# EAGLE design sanguinololu (EAGLE 5.11)
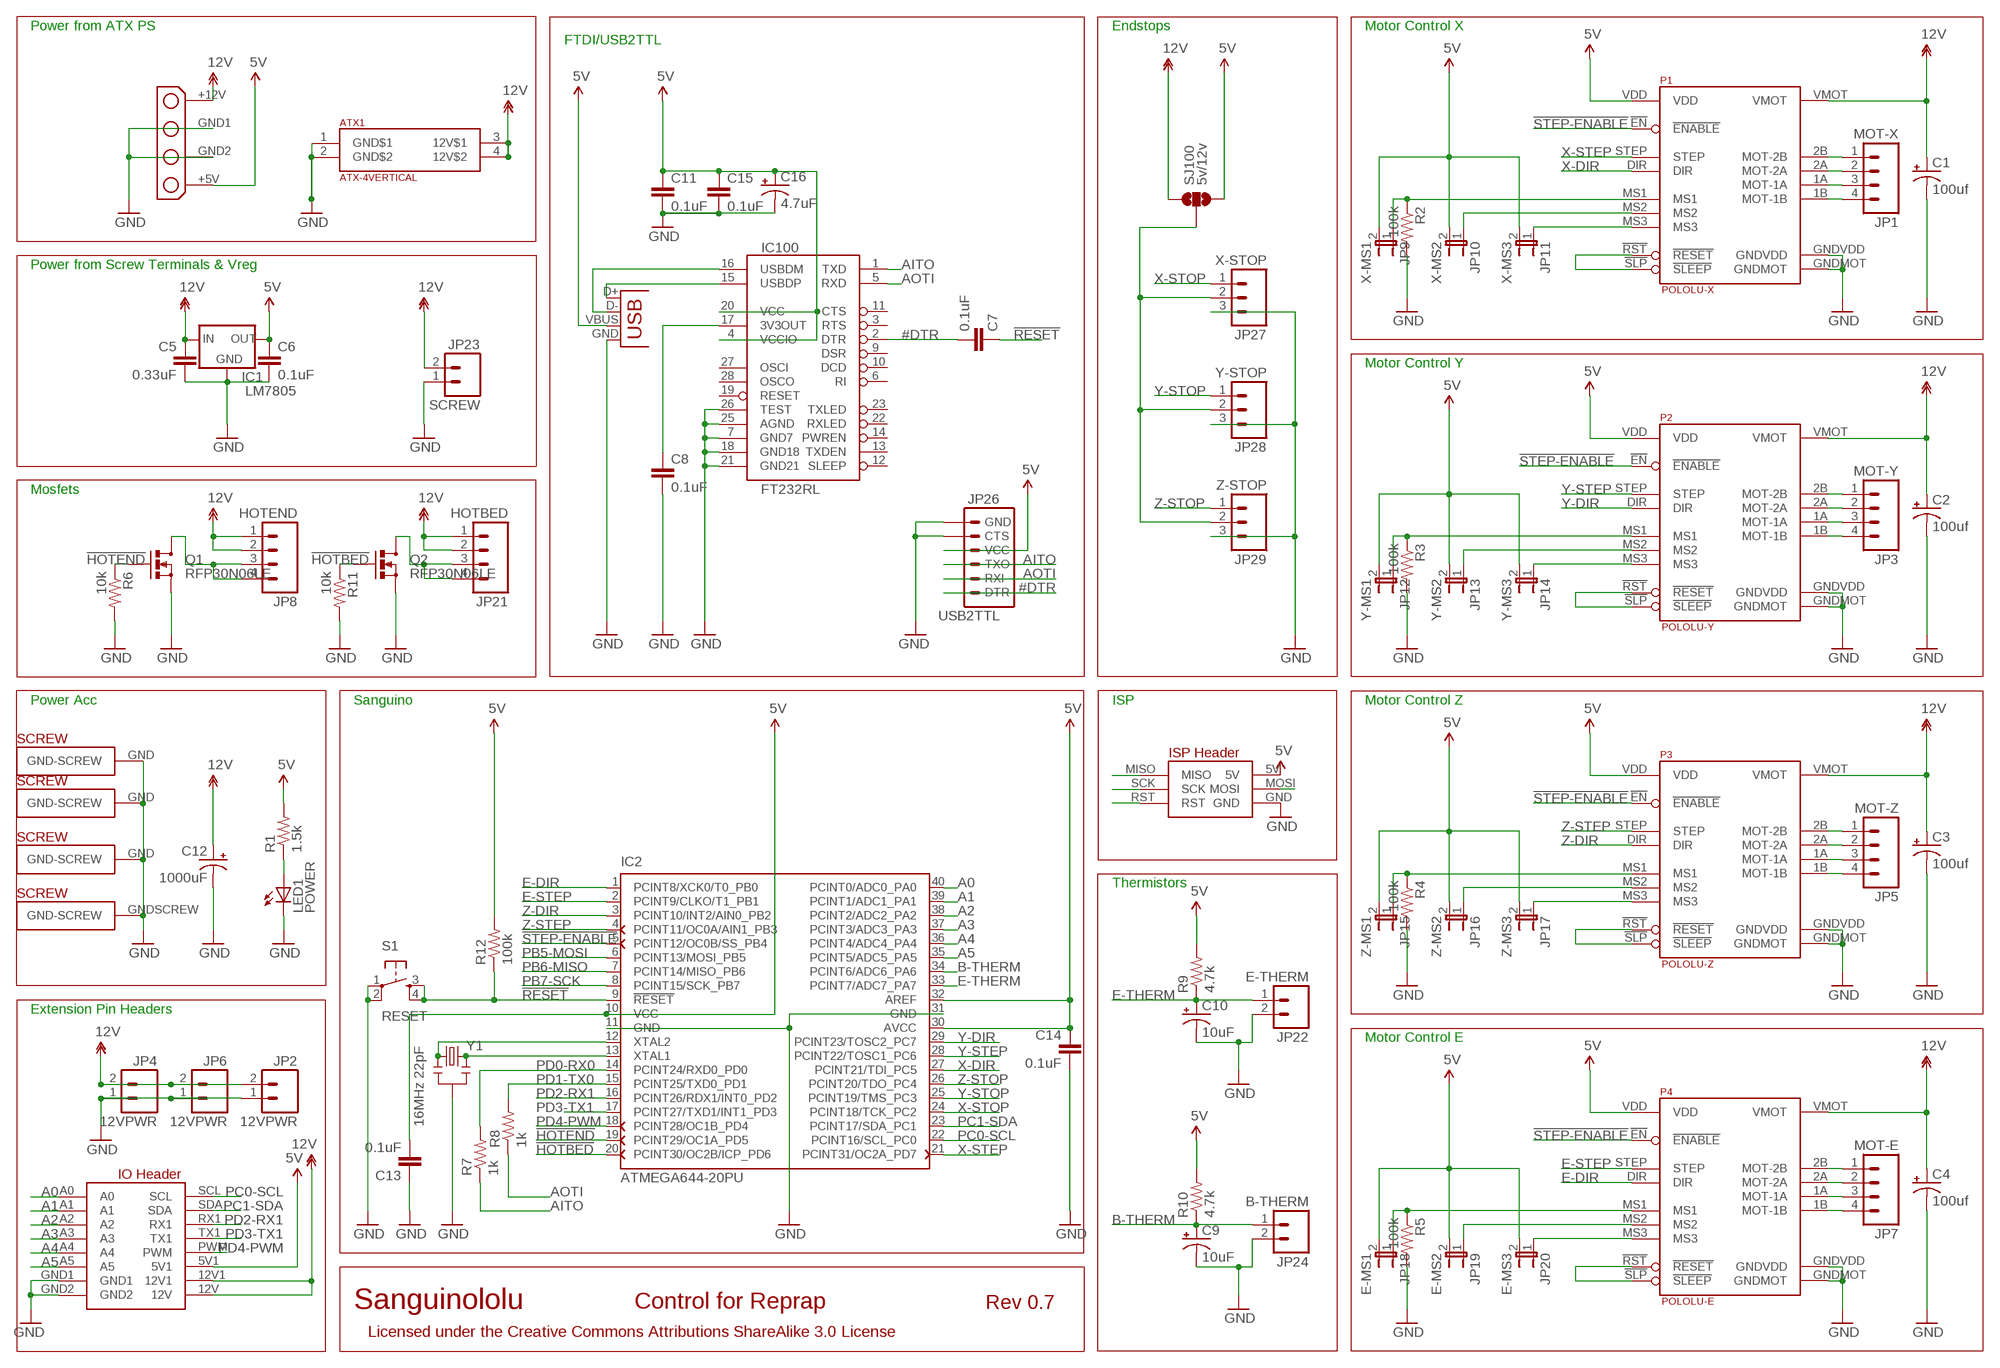
[diagram p0: schematic, sheet 1]

## Parts
ATX1  ATX-4VERTICAL  [MINIFITJR-4-VERTICAL]
C1  100uf  CAP_POLPTH1  [CPOL-RADIAL-100UF-25V]
C2  100uf  CAP_POLPTH1  [CPOL-RADIAL-100UF-25V]
C3  100uf  CAP_POLPTH1  [CPOL-RADIAL-100UF-25V]
C4  100uf  CAP_POLPTH1  [CPOL-RADIAL-100UF-25V]
C5  0.33uF  CAPPTH2  [CAP-PTH-SMALL2]
C6  0.1uF  CAPPTH2  [CAP-PTH-SMALL2]
C7  0.1uF  CAPPTH2  [CAP-PTH-SMALL2]
C8  0.1uF  CAPPTH2  [CAP-PTH-SMALL2]
C9  10uF  CAP_POLPTH2  [CPOL-RADIAL-10UF-25V]
C10  10uF  CAP_POLPTH2  [CPOL-RADIAL-10UF-25V]
C11  0.1uF  CAPPTH2  [CAP-PTH-SMALL2]
C12  1000uF  CAP_POLPTH4  [CPOL-RADIAL-1000UF-25V]
C13  0.1uF  CAPPTH2  [CAP-PTH-SMALL2]
C14  0.1uF  CAPPTH2  [CAP-PTH-SMALL2]
C15  0.1uF  CAPPTH2  [CAP-PTH-SMALL2]
C16  4.7uF  CAP_POLPTH2  [CPOL-RADIAL-10UF-25V]
HDDPWR  5v/12v  DRIVEPWRVERTICAL  [HDD-VERTICAL]
IC1  LM7805  V_REG_78XX  [78XXL-CUSTOM]
IC2  ATMEGA644-20PU  [DIL40]
IC100  FT232RL  FT232RLSSOP  [SSOP28DB]
J1  USB  USBPTH  [USB-B-PTH]
JP1  MOT-X  M04POLAR  [MOLEX-1X4]
JP2  12VPWR  M02POLAR  [MOLEX-1X2]
JP3  MOT-Y  M04POLAR  [MOLEX-1X4]
JP4  12VPWR  M02POLAR  [MOLEX-1X2]
JP5  MOT-Z  M04POLAR  [MOLEX-1X4]
JP6  12VPWR  M02POLAR  [MOLEX-1X2]
JP7  MOT-E  M04POLAR  [MOLEX-1X4]
JP8  HOTEND  M04POLAR  [MOLEX-1X4]
JP9  X-MS1  JUMPER-2PTH  [1X02]
JP10  X-MS2  JUMPER-2PTH  [1X02]
JP11  X-MS3  JUMPER-2PTH  [1X02]
JP12  Y-MS1  JUMPER-2PTH  [1X02]
JP13  Y-MS2  JUMPER-2PTH  [1X02]
JP14  Y-MS3  JUMPER-2PTH  [1X02]
JP15  Z-MS1  JUMPER-2PTH  [1X02]
JP16  Z-MS2  JUMPER-2PTH  [1X02]
JP17  Z-MS3  JUMPER-2PTH  [1X02]
JP18  E-MS1  JUMPER-2PTH  [1X02]
JP19  E-MS2  JUMPER-2PTH  [1X02]
JP20  E-MS3  JUMPER-2PTH  [1X02]
JP21  HOTBED  M04POLAR  [MOLEX-1X4]
JP22  E-THERM  M02PTH  [1X02]
JP23  SCREW  M025MM  [SCREWTERMINAL-5MM-2]
JP24  B-THERM  M02PTH  [1X02]
JP26  USB2TTL  ARDUINO_SERIAL_PROGRAMPTH  [1X06]
JP27  X-STOP  M03POLAR  [MOLEX-1X3]
JP28  Y-STOP  M03POLAR  [MOLEX-1X3]
JP29  Z-STOP  M03POLAR  [MOLEX-1X3]
LED1  POWER  LED3MM  [LED3MM]
P1  POLOLU-X  POLOLU-ALLEGRO  [POLOLU-ALLEGRO-PTH]
P2  POLOLU-Y  POLOLU-ALLEGRO  [POLOLU-ALLEGRO-PTH]
P3  POLOLU-Z  POLOLU-ALLEGRO  [POLOLU-ALLEGRO-PTH]
P4  POLOLU-E  POLOLU-ALLEGRO  [POLOLU-ALLEGRO-PTH]
Q1  RFP30N06LE  MOSFET-NCHANNELPTH2  [TO220V]
Q2  RFP30N06LE  MOSFET-NCHANNELPTH2  [TO220V]
R1  1.5k  RESISTORPTH1  [AXIAL-0.3]
R2  100k  RESISTORPTH1  [AXIAL-0.3]
R3  100k  RESISTORPTH1  [AXIAL-0.3]
R4  100k  RESISTORPTH1  [AXIAL-0.3]
R5  100k  RESISTORPTH1  [AXIAL-0.3]
R6  10k  RESISTORPTH1  [AXIAL-0.3]
R7  1k  RESISTORPTH1  [AXIAL-0.3]
R8  1k  RESISTORPTH1  [AXIAL-0.3]
R9  4.7k  RESISTORPTH1  [AXIAL-0.3]
R10  4.7k  RESISTORPTH1  [AXIAL-0.3]
R11  10k  RESISTORPTH1  [AXIAL-0.3]
R12  100k  RESISTORPTH1  [AXIAL-0.3]
S1  RESET  TAC_SWITCHPTH  [TACTILE-PTH]
SJ100  5v/12v  SOLDERJUMPER_2WAYS  [SJ_3]
U$17  PLATED-SCREW  [PLATEDSCREW]
U$24  IO_HEADERS_SCREW  [IO_HEADER-PLATEDSCREW]
U$37  PLATED-SCREW  [PLATEDSCREW]
U$38  PLATED-SCREW  [PLATEDSCREW]
Y1  16MHz 22pF  RESONATORPTH  [RESONATOR-PTH]

## Nets
3V3: C8.1 IC100.17(3V3OUT)
5V: C6.1 C11.1 C13.2 C14.1 C15.1 C16.1(+) HDDPWR.+5V IC1.OUT IC2.10(VCC) IC2.30(AVCC) IC2.32(AREF) IC100.4(VCCIO) IC100.20(VCC) J1.VBUS JP9.2 JP10.2 JP11.2 JP12.2 JP13.2 JP14.2 JP15.2 JP16.2 JP17.2 JP18.2 JP19.2 JP20.2 JP26.4(VCC) P1.VDD P2.VDD P3.VDD P4.VDD R1.P$2 R9.P$2 R10.P$2 R12.P$2 SJ100.3 U$24.5V U$24.5V1
12V: ATX1.3(12V$1) ATX1.4(12V$2) C1.1(+) C2.1(+) C3.1(+) C4.1(+) C5.1 C12.1(+) HDDPWR.+12V IC1.IN JP2.2 JP4.2 JP6.2 JP8.1 JP8.2 JP21.1 JP21.2 JP23.2 P1.VMOT P2.VMOT P3.VMOT P4.VMOT SJ100.1 U$24.12V U$24.12V1
!HOTBED: IC2.20(PCINT30/OC2B/ICP_PD6) Q2.1(G) R11.P$1
!HOTEND: IC2.19(PCINT29/OC1A_PD5) Q1.1(G) R6.P$1
!RESET: C7.1 IC2.9(!RESET) R12.P$1 S1.3 S1.4 U$24.RST
!STEP-ENABLE: IC2.5(PCINT12/OC0B/SS_PB4) P1.!EN(!ENABLE) P2.!EN(!ENABLE) P3.!EN(!ENABLE) P4.!EN(!ENABLE)
#DTR: C7.2 IC100.2(DTR) JP26.1(DTR)
A0: IC2.40(PCINT0/ADC0_PA0) U$24.A0
A1: IC2.39(PCINT1/ADC1_PA1) U$24.A1
A2: IC2.38(PCINT2/ADC2_PA2) U$24.A2
A3: IC2.37(PCINT3/ADC3_PA3) U$24.A3
A4: IC2.36(PCINT4/ADC4_PA4) U$24.A4
A5: IC2.35(PCINT5/ADC5_PA5) U$24.A5
AITO: IC100.1(TXD) JP26.3(TXO) R7.P$1
AOTI: IC100.5(RXD) JP26.2(RXI) R8.P$1
B-THERM: C9.1(+) IC2.34(PCINT6/ADC6_PA6) JP24.1 R10.P$1
E-DIR: IC2.1(PCINT8/XCK0/T0_PB0) P4.DIR
E-MOT-1A [power]: JP7.3 P4.1A(MOT-1A)
E-MOT-1B [power]: JP7.4 P4.1B(MOT-1B)
E-MOT-2A [power]: JP7.2 P4.2A(MOT-2A)
E-MOT-2B [power]: JP7.1 P4.2B(MOT-2B)
E-MS1: JP18.1 P4.MS1 R5.P$1
E-MS2: JP19.1 P4.MS2
E-MS3: JP20.1 P4.MS3
E-RESETSLEEP: P4.!RST(!RESET) P4.!SLP(!SLEEP)
E-STEP: IC2.2(PCINT9/CLKO/T1_PB1) P4.STEP
E-THERM: C10.1(+) IC2.33(PCINT7/ADC7_PA7) JP22.1 R9.P$1
ENDSTOP+V: JP27.2 JP28.2 JP29.2 SJ100.2
GND [power]: ATX1.1(GND$1) ATX1.2(GND$2) C1.2(-) C2.2(-) C3.2(-) C4.2(-) C5.2 C6.2 C8.2 C9.2(-) C10.2(-) C11.2 C12.2(-) C13.1 C14.2 C15.2 C16.2(-) HDDPWR.GND1(GND) HDDPWR.GND2(_GND) IC1.GND IC2.11(GND) IC2.31(GND) IC100.7(GND7) IC100.18(GND18) IC100.21(GND21) IC100.25(AGND) IC100.26(TEST) J1.GND JP2.1 JP4.1 JP6.1 JP22.2 JP23.1 JP24.2 JP26.5(CTS) JP26.6(GND) JP27.3 JP28.3 JP29.3 LED1.K(C) P1.GNDMOT P1.GNDVDD P2.GNDMOT P2.GNDVDD P3.GNDMOT P3.GNDVDD P4.GNDMOT P4.GNDVDD Q1.3(S) Q2.3(S) R2.P$2 R3.P$2 R4.P$2 R5.P$2 R6.P$2 R11.P$2 S1.1 S1.2 U$17.GND(GND-SCREW) U$24.GND U$24.GND1 U$24.GND2 U$24.GNDSCREW(GND-SCREW) U$37.GND(GND-SCREW) U$38.GND(GND-SCREW) Y1.2
HOTBED-GND [power]: JP21.3 JP21.4 Q2.2(D)
HOTEND-GND [power]: JP8.3 JP8.4 Q1.2(D)
LED1: LED1.A R1.P$1
PB5-MOSI: IC2.6(PCINT13/MOSI_PB5) U$24.MOSI
PB6-MISO: IC2.7(PCINT14/MISO_PB6) U$24.MISO
PB7-SCK: IC2.8(PCINT15/SCK_PB7) U$24.SCK
PC0-SCL: IC2.22(PCINT16/SCL_PC0) U$24.SCL
PC1-SDA: IC2.23(PCINT17/SDA_PC1) U$24.SDA
PD0-RX0: IC2.14(PCINT24/RXD0_PD0) R7.P$2
PD1-TX0: IC2.15(PCINT25/TXD0_PD1) R8.P$2
PD2-RX1: IC2.16(PCINT26/RDX1/INT0_PD2) U$24.RX1
PD3-TX1: IC2.17(PCINT27/TXD1/INT1_PD3) U$24.TX1
PD4-PWM: IC2.18(PCINT28/OC1B_PD4) U$24.PWM
USBDM: IC100.16(USBDM) J1.D-
USBDP: IC100.15(USBDP) J1.D+
X-DIR: IC2.27(PCINT21/TDI_PC5) P1.DIR
X-MOT-1A [power]: JP1.3 P1.1A(MOT-1A)
X-MOT-1B [power]: JP1.4 P1.1B(MOT-1B)
X-MOT-2A [power]: JP1.2 P1.2A(MOT-2A)
X-MOT-2B [power]: JP1.1 P1.2B(MOT-2B)
X-MS1: JP9.1 P1.MS1 R2.P$1
X-MS2: JP10.1 P1.MS2
X-MS3: JP11.1 P1.MS3
X-RESETSLEEP: P1.!RST(!RESET) P1.!SLP(!SLEEP)
X-STEP: IC2.21(PCINT31/OC2A_PD7) P1.STEP
X-STOP: IC2.24(PCINT18/TCK_PC2) JP27.1
XTAL1: IC2.13(XTAL1) Y1.3
XTAL2: IC2.12(XTAL2) Y1.1
Y-DIR: IC2.29(PCINT23/TOSC2_PC7) P2.DIR
Y-MOT-1A [power]: JP3.3 P2.1A(MOT-1A)
Y-MOT-1B [power]: JP3.4 P2.1B(MOT-1B)
Y-MOT-2A [power]: JP3.2 P2.2A(MOT-2A)
Y-MOT-2B [power]: JP3.1 P2.2B(MOT-2B)
Y-MS1: JP12.1 P2.MS1 R3.P$1
Y-MS2: JP13.1 P2.MS2
Y-MS3: JP14.1 P2.MS3
Y-RESETSLEEP: P2.!RST(!RESET) P2.!SLP(!SLEEP)
Y-STEP: IC2.28(PCINT22/TOSC1_PC6) P2.STEP
Y-STOP: IC2.25(PCINT19/TMS_PC3) JP28.1
Z-DIR: IC2.3(PCINT10/INT2/AIN0_PB2) P3.DIR
Z-MOT-1A [power]: JP5.3 P3.1A(MOT-1A)
Z-MOT-1B [power]: JP5.4 P3.1B(MOT-1B)
Z-MOT-2A [power]: JP5.2 P3.2A(MOT-2A)
Z-MOT-2B [power]: JP5.1 P3.2B(MOT-2B)
Z-MS1: JP15.1 P3.MS1 R4.P$1
Z-MS2: JP16.1 P3.MS2
Z-MS3: JP17.1 P3.MS3
Z-RESETSLEEP: P3.!RST(!RESET) P3.!SLP(!SLEEP)
Z-STEP: IC2.4(PCINT11/OC0A/AIN1_PB3) P3.STEP
Z-STOP: IC2.26(PCINT20/TDO_PC4) JP29.1
Unconnected: IC100.3(RTS) IC100.6(RI) IC100.9(DSR) IC100.10(DCD) IC100.11(CTS) IC100.12(SLEEP) IC100.13(TXDEN) IC100.14(PWREN) IC100.19(RESET) IC100.22(RXLED) IC100.23(TXLED) IC100.27(OSCI) IC100.28(OSCO)

## Notes on the sheet
- Power from ATX PS | Endstops | Motor Control X
- FTDI/USB2TTL
- Power from Screw Terminals & Vreg
- Motor Control Y
- Mosfets
- Power Acc | Sanguino | ISP | Motor Control Z
- Thermistors
- Extension Pin Headers
- Motor Control E
- Sanguinololu | Control for Reprap | Rev 0.7
- Licensed under the Creative Commons Attributions ShareAlike 3.0 License

## Library data of the parts
ATX1 = atx-power-supply:ATX-4
C1-C4 C9 C10 C12 C16 = SparkFun:CAP_POL: Capacitor Polarized These are standard SMD and PTH capacitors. Normally 10uF, 47uF, and 100uF in electrolytic and tantalum varieties. Always verify the external diameter of the through hole cap, it varies with capacity, voltage, and manufacturer. The EIA devices should be standard.
C5-C8 C11 C13-C15 = SparkFun:CAP: Capacitor Standard 0603 ceramic capacitor, and 0.1" leaded capacitor.
HDDPWR = atx-power-supply:DRIVEPWR
IC1 = SparkFun:V_REG_78XX: Voltage Regulator Standard 7805 5V regulator. IGO (Input Ground Output). Spark Fun Electronics SKU : COM-00107
IC2 = atmel:ATMEGA644-*PU: 8-bit Microcontroller with 64K Bytes In-System Programmable Flash Auto generated by make-symbol-device-package-bsdl.ulp Rev. 34 Source: http://www.atmel.com/dyn/resources/prod_documents/doc2593.pdf; MPN: ATMEGA644-20PU; OC_FARNELL: 1288340; OC_NEWARK: 23M5060
IC100 = SparkFun:FT232RL: USB UART FT232RL 4th Generation USB UART (USB <-> Serial) Controller. Spark Fun Electronics SKU : COM-00650
J1 = SparkFun:USB: USB Connectors USB-B-PTH is fully proven SKU : PRT-00139 USB-miniB is fully proven SKU : PRT-00587 USB-A-PCB is untested. USB-A-H is throughly reviewed, but untested. Spark Fun Electronics SKU : PRT-00437 USB-B-SMT is throughly reviewed, but untested. Needs silkscreen touching up. USB-A-S has not been used/tested USB-MB-H has not been used/tested
JP1 JP3 JP5 JP7 JP8 JP21 = SparkFun:M04: Header 4 Standard 4-pin 0.1" header. Use with straight break away headers (SKU : PRT-00116), right angle break away headers (PRT-00553), swiss pins (PRT-00743), machine pins (PRT-00117), and female headers (PRT-00115). Molex polarized connector foot print use with SKU : PRT-08231 with associated crimp pins and housings.
JP2 JP4 JP6 JP22-JP24 = SparkFun:M02: Header 2 Standard 2-pin 0.1" header. Use with straight break away headers (SKU : PRT-00116), right angle break away headers (PRT-00553), swiss pins (PRT-00743), machine pins (PRT-00117), and female headers (PRT-00115). Molex polarized connector foot print use with SKU : PRT-08233 with associated crimp pins and housings.
JP9-JP20 = SparkFun:JUMPER-2: Jumper Basic 0.1" spaced jumper. Use with breakaway headers.
JP26 = SparkFun:ARDUINO_SERIAL_PROGRAM
JP27-JP29 = SparkFun:M03: Header 3 Standard 3-pin 0.1" header. Use with straight break away headers (SKU : PRT-00116), right angle break away headers (PRT-00553), swiss pins (PRT-00743), machine pins (PRT-00117), and female headers (PRT-00115). Molex polarized connector foot print use with SKU : PRT-08232 with associated crimp pins and housings.
LED1 = SparkFun:LED: LEDs Standard schematic elements and footprints for 5mm, 3mm, 1206, and 0603 sized LEDs. 5mm - Spark Fun Electronics SKU : COM-00529 (and others)
P1-P4 = pololu-allegro:POLOLU-ALLEGRO
Q1 Q2 = SparkFun:MOSFET-NCHANNEL
R1-R12 = SparkFun:RESISTOR: Resistor Basic schematic elements and footprints for 0603, 1206, and PTH 1/10th watt (small) resistors.
S1 = SparkFun:TAC_SWITCH: Momentary Switch Button commonly used for reset or general input. Spark Fun Electronics SKU : COM-00097
SJ100 = SparkFun:SOLDERJUMPER_2WAY: Solder Jumper 2 way solder jumper
U$17 U$37 U$38 = Sanguinololu:PLATED-SCREW
U$24 = Sanguinololu:IO_HEADERS_SCREW
Y1 = SparkFun:RESONATOR: Resonator Small SMD resonator. This is the itty bitty 10/20MHz resonators with built in caps. CSTCE10M0G55 and CSTCE20M0V53. Footprint has been reviewed closely but hasn't been tested yet.

## Board
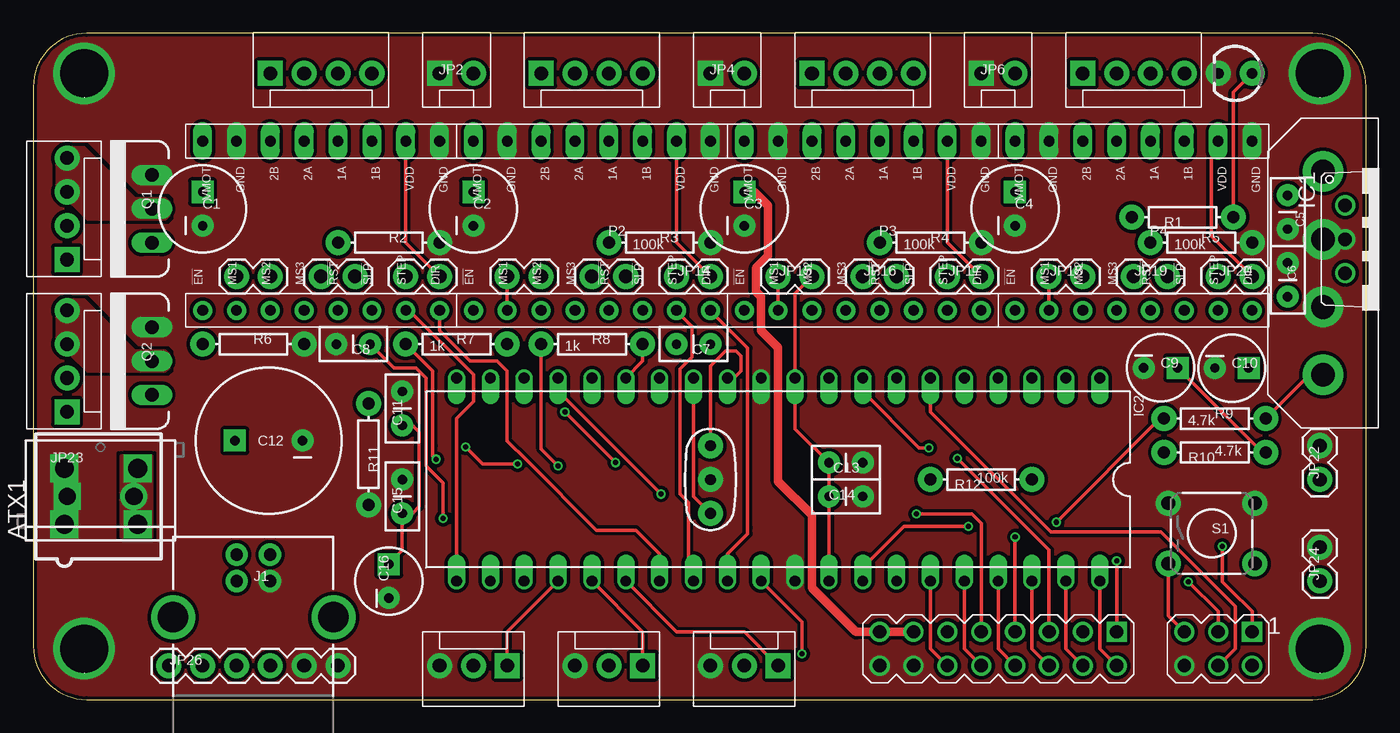
[diagram p1: board, top side]
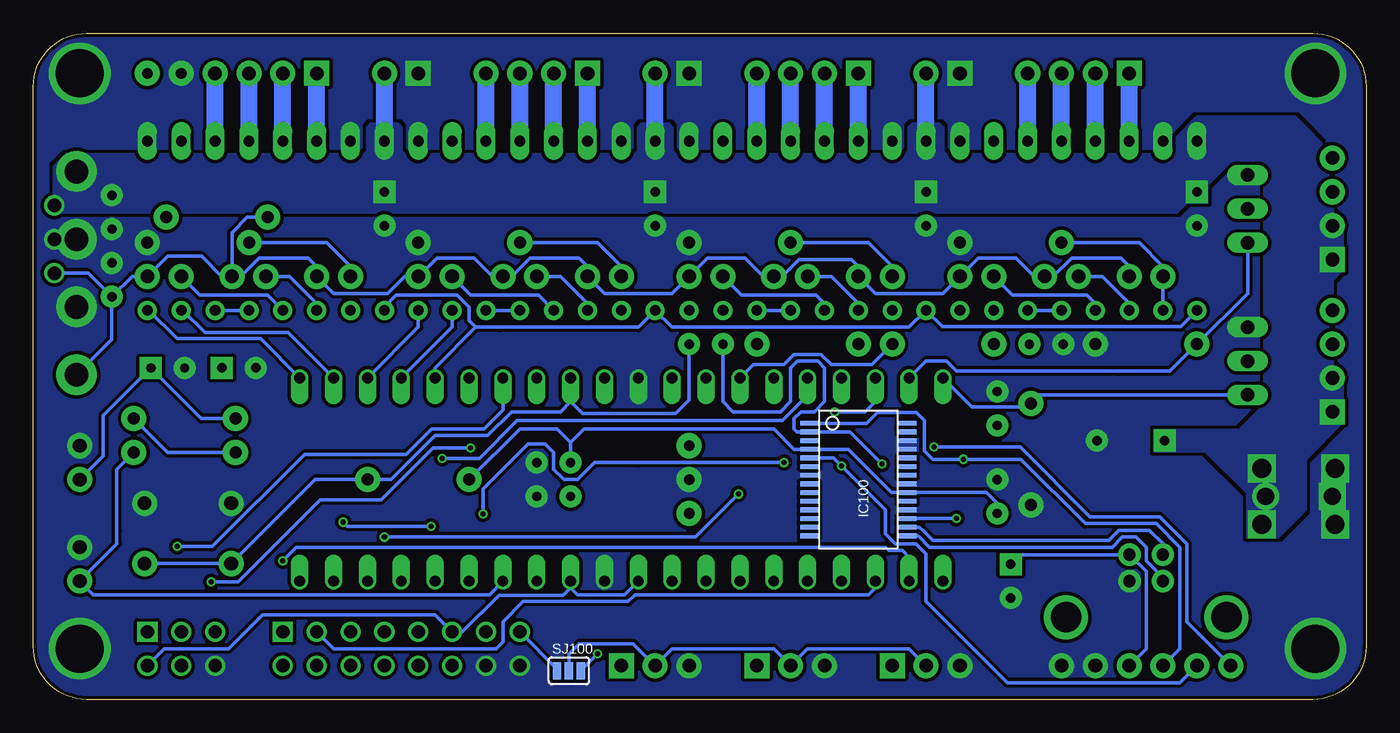
[diagram p2: board, bottom side, seen from below]

Size 100 x 50 mm. Coordinates in mm from the lower left corner, seen from the top.
Outline: 0,4 arc90 4,0 96,0 arc90 100,4 100,46 arc90 96,50 4,50 arc90 0,46 0,4
Copper layers (1*16): Top 0.035mm / dielectric 1.5mm / Bottom 0.035mm
Design rules "Fusion_eagle_rule_v1.1-strict": minimum track width 10mil, minimum drill 15mil, track to track 8mil, track to pad 8mil, pad to pad 8mil, via to via 8mil, smd to smd 0mil, copper to edge 10mil, drill to drill 10mil, minimum pad ring 10mil, minimum via ring 6mil, stop-mask expansion 2mil, vias tented up to drill 100mil, thermal gap 10mil

### Footprints (pad centres in the part's own frame; a part is rotated, then mirrored left to right if it is on the bottom)
MINIFITJR-4-VERTICAL = drill 1.4 square: 1 2.1,-2.75; 2 -2.1,-2.75; 3 2.1,2.75; 4 -2.1,2.75
CPOL-RADIAL-100UF-25V = drill 0.7 pad 1.651 square: 1 1.27,0 | drill 0.7 pad 1.651 round: 2 -1.27,0
CAP-PTH-SMALL2 = drill 0.7 pad 1.651 round: 1 0,0; 2 2.54,0
CPOL-RADIAL-10UF-25V = drill 0.7 pad 1.651 square: 1 1.27,0 | drill 0.7 pad 1.651 round: 2 -1.27,0
CPOL-RADIAL-1000UF-25V = drill 0.7 pad 1.651 square: 1 2.54,0 | drill 0.7 pad 1.651 round: 2 -2.54,0
HDD-VERTICAL = drill 1.778 pad 3.048 round: +5V -15.24,0; +12V 0,0; GND1 -10.16,0; GND2 -5.08,0
78XXL-CUSTOM = drill 1.016 round: GND 0,0; IN -2.54,0; OUT 2.54,0
DIL40 = drill 0.813 offset: 1 -24.13,-7.62; 2 -21.59,-7.62; 3 -19.05,-7.62; 4 -16.51,-7.62; 5 -13.97,-7.62; 6 -11.43,-7.62; 7 -8.89,-7.62; 8 -6.35,-7.62; 9 -3.81,-7.62; 10 -1.27,-7.62; 11 1.27,-7.62; 12 3.81,-7.62; 13 6.35,-7.62; 14 8.89,-7.62; 15 11.43,-7.62; 16 13.97,-7.62; 17 16.51,-7.62; 18 19.05,-7.62; 19 21.59,-7.62; 20 24.13,-7.62; 21 24.13,7.62; 22 21.59,7.62; 23 19.05,7.62; 24 16.51,7.62; 25 13.97,7.62; 26 11.43,7.62; 27 8.89,7.62; 28 6.35,7.62; 29 3.81,7.62; 30 1.27,7.62; 31 -1.27,7.62; 32 -3.81,7.62; 33 -6.35,7.62; 34 -8.89,7.62; 35 -11.43,7.62; 36 -13.97,7.62; 37 -16.51,7.62; 38 -19.05,7.62; 39 -21.59,7.62; 40 -24.13,7.62
SSOP28DB = smd 0.348 x 1.397: 1 -4.225,-3.656; 2 -3.575,-3.656; 3 -2.925,-3.656; 4 -2.275,-3.656; 5 -1.625,-3.656; 6 -0.975,-3.656; 7 -0.325,-3.656; 8 0.325,-3.656; 9 0.975,-3.656; 10 1.625,-3.656; 11 2.275,-3.656; 12 2.925,-3.656; 13 3.575,-3.656; 14 4.225,-3.656; 15 4.225,3.656; 16 3.575,3.656; 17 2.925,3.656; 18 2.275,3.656; 19 1.625,3.656; 20 0.975,3.656; 21 0.325,3.656; 22 -0.325,3.656; 23 -0.975,3.656; 24 -1.625,3.656; 25 -2.275,3.656; 26 -2.925,3.656; 27 -3.575,3.656; 28 -4.225,3.656
USB-B-PTH = drill 0.914 pad 1.676 round: D+ 0,1.25; D- 1.981,1.25; GND 0,-1.25; VBUS 1.981,-1.25 | drill 2.286 round: P$1 -2.718,-6.02; P$2 -2.718,6.02
MOLEX-1X4 = drill 1.016 pad 1.88 square: 1 0,0 | drill 1.016 pad 1.88 round: 2 2.54,0; 3 5.08,0; 4 7.62,0
MOLEX-1X2 = drill 1.016 pad 1.88 square: 1 0,0 | drill 1.016 pad 1.88 round: 2 2.54,0
1X02 = drill 1.016 pad 1.88 round: 1 0,0; 2 2.54,0
SCREWTERMINAL-5MM-2 = drill 1.3 pad 2.032 square: 1 0,0 | drill 1.3 pad 2.032 round: 2 5,0
1X06 = drill 1.016 pad 1.88 round: 1 0,0; 2 2.54,0; 3 5.08,0; 4 7.62,0; 5 10.16,0; 6 12.7,0
MOLEX-1X3 = drill 1.016 pad 1.88 square: 1 0,0 | drill 1.016 pad 1.88 round: 2 2.54,0; 3 5.08,0
LED3MM = drill 0.813 pad 1.88 round: A -1.27,0; K 1.27,0
POLOLU-ALLEGRO-PTH = drill 0.8 pad 1.422 long: 1A 6.35,-1.27; 1B 6.35,-3.81; 2A 6.35,1.27; 2B 6.35,3.81; GNDMOT 6.35,6.35; GNDVDD 6.35,-8.89; VDD 6.35,-6.35; VMOT 6.35,8.89 | drill 0.8 pad 1.422 round: !EN -6.35,8.89; !RST -6.35,-1.27; !SLP -6.35,-3.81; DIR -6.35,-8.89; MS1 -6.35,6.35; MS2 -6.35,3.81; MS3 -6.35,1.27; STEP -6.35,-6.35
TO220V = drill 1.016 long: 1 -2.54,0; 2 0,0; 3 2.54,0
AXIAL-0.3 = drill 0.9 pad 1.88 round: P$1 -3.81,0; P$2 3.81,0
TACTILE-PTH = drill 1.016 pad 1.88 round: 1 -3.251,2.261; 2 3.251,2.261; 3 -3.251,-2.261; 4 3.251,-2.261
SJ_3 = smd 0.635 x 1.27: 1 -0.889,0; 2 0,0; 3 0.889,0
PLATEDSCREW = drill 3.6 round: GND 0,0
IO_HEADER-PLATEDSCREW = drill 1 round: 5V -5.08,-1.27; 5V1 -27.94,1.27; 12V -33.02,1.27; 12V1 -30.48,1.27; A0 -15.24,-1.27; A1 -17.78,-1.27; A2 -20.32,-1.27; A3 -22.86,-1.27; A4 -25.4,-1.27; A5 -27.94,-1.27; GND -10.16,-1.27; GND1 -30.48,-1.27; GND2 -33.02,-1.27; MOSI -7.62,-1.27; PWM -25.4,1.27; RST -10.16,1.27; RX1 -20.32,1.27; SCK -7.62,1.27; SDA -17.78,1.27; TX1 -22.86,1.27 | drill 3.6 round: GNDSCREW 0,0 | drill 1 square: MISO -5.08,1.27; SCL -15.24,1.27
RESONATOR-PTH = drill 0.8 pad 1.88 round: 1 -2.54,0; 2 0,0; 3 2.54,0

### Placement (x,y rotation side)
ATX1  5.08,15.24 270 top
C1  12.7,36.83 90 top
C2  33.02,36.83 90 top
C3  53.34,36.83 90 top
C4  73.66,36.83 90 top
C5  94.11,37.85 270 top
C6  94.11,30.23 90 top
C7  50.8,26.67 180 top
C8  25.27,26.67 180 top
C9  84.58,24.89 0 top
C10  89.92,24.88 0 top
C11  27.69,20.57 90 top
C12  17.65,19.43 180 top
C13  62.23,17.78 180 top
C14  59.69,15.24 0 top
C15  27.69,13.97 90 top
C16  26.67,8.89 90 top
HDDPWR  96.76,39.62 90 top
IC1  98.42,34.54 270 top
IC2  55.88,16.51 180 top
IC100  38.1,16.51 270 bottom
J1  16.51,8.89 90 top
JP1  17.78,46.99 0 top
JP2  30.48,46.99 0 top
JP3  38.1,46.99 0 top
JP4  50.8,46.99 0 top
JP5  58.42,46.99 0 top
JP6  71.12,46.99 0 top
JP7  78.74,46.99 0 top
JP8  2.54,33.02 90 top
JP9  15.24,31.75 0 top
JP10  21.59,31.75 0 top
JP11  27.94,31.75 0 top
JP12  35.56,31.75 0 top
JP13  41.91,31.75 0 top
JP14  48.26,31.75 0 top
JP15  55.88,31.75 0 top
JP16  62.23,31.75 0 top
JP17  68.58,31.75 0 top
JP18  76.2,31.75 0 top
JP19  82.55,31.75 0 top
JP20  88.9,31.75 0 top
JP21  2.54,21.59 90 top
JP22  96.52,16.51 90 top
JP23  2.54,15.24 0 top
JP24  96.52,8.89 90 top
JP26  10.16,2.54 0 top
JP27  35.56,2.54 180 top
JP28  45.72,2.54 180 top
JP29  55.88,2.54 180 top
LED1  90.17,46.99 180 top
P1  21.59,35.56 90 top
P2  41.91,35.56 90 top
P3  62.23,35.56 90 top
P4  82.55,35.56 90 top
Q1  8.89,36.83 90 top
Q2  8.89,25.4 90 top
R1  86.23,36.2 180 top
R2  26.67,34.29 0 top
R3  46.99,34.29 0 top
R4  67.31,34.29 0 top
R5  87.63,34.29 0 top
R6  16.51,26.67 0 top
R7  31.75,26.67 0 top
R8  41.91,26.67 0 top
R9  88.65,21.08 0 top
R10  88.65,18.54 180 top
R11  25.15,18.41 270 top
R12  71.12,16.51 180 top
S1  88.41,12.46 0 top
SJ100  59.82,2.16 0 bottom
U$17  3.81,3.81 0 top
U$24  96.52,3.81 0 top
U$37  3.81,46.99 0 top
U$38  96.52,46.99 0 top
Y1  50.8,16.51 270 top

### Tracks (layer width: path | path; a pad name or v marks a point on that pad's centre or on a via)
3V3  (via drill 0.38)
  Top 0.254: v30.73,13.59 30.73,16.26 29.46,17.53 29.46,24.13 28.7,24.89 27.05,24.89 C8.1
  Bottom 0.254: v30.73,13.59 IC100.17
5V  (via drill 0.38)
  Top 0.254: IC2.32 C14.1 C13.2 57.15,20.32 IC2.10 57.15,30.48 JP15.2 | P1.VDD 27.94,34.29 JP11.2 | P2.VDD 48.26,34.29 JP14.2 | P3.VDD 68.58,34.29 JP17.2 | P4.VDD 88.9,41.15 88.39,40.64 88.39,34.8 JP20.2 | v57.66,3.43 57.66,5.84 IC2.30 | C16.1 27.69,11.18 C15.1 28.45,13.97 28.96,14.48 28.96,19.3 28.96,20.07 28.45,20.57 C11.1 | R9.P$2 95.76,24.38 HDDPWR.+5V
  Bottom 0.254: IC100.20 34.44,15.49 | 59.69,8.38 59.18,7.87 55.63,7.87 IC2.30 | IC2.32 59.69,8.38 | 59.69,8.38 60.25,7.82 63.93,7.82 65.08,7.82 67.82,5.08 U$24.5V1 69.85,6.35 82.8,6.35 85.34,3.81 90.17,3.81 U$24.5V | IC100.20 35.6,15.54 38.85,18.79 IC100.4 42.91,18.79 44.45,20.32 58.67,20.32 59.69,19.3 | R12.P$2 63.5,20.32 60.71,20.32 59.69,19.3 | 59.69,19.3 C13.2 | R10.P$2 89.92,18.54 R9.P$2 | JP9.2 17.78,32.51 18.41,33.15 22.1,33.15 23.5,31.75 JP10.2 24.89,31.75 26.29,33.15 29.08,33.15 JP11.2 31.75,30.48 36.83,30.48 JP12.2 38.1,32.51 38.61,33.02 42.55,33.02 43.81,31.75 JP13.2 45.21,31.75 46.61,33.15 49.4,33.15 JP14.2 52.07,30.48 57.15,30.48 JP15.2 58.42,32.51 59.05,33.15 62.74,33.15 64.14,31.75 JP16.2 65.53,31.75 66.93,33.15 69.72,33.15 JP17.2 71.63,31.75 | JP19.2 84.45,31.75 83.06,33.15 79.38,33.15 78.74,32.51 JP18.2 77.47,30.48 73.41,30.48 72.14,31.75 | JP19.2 85.85,31.75 87.38,33.27 89.92,33.27 JP20.2 92.58,31.75 C6.1 | R1.P$2 83.95,36.2 85.09,35.05 JP19.2 | 58.8,2.16 SJ100.3 v57.66,3.43 | IC100.20 28.49,15.54 27.69,14.73 C15.1 | JP26.4 16.51,3.81 16.51,9.62 J1.VBUS 25.96,10.87 C16.1 | 71.63,31.75 72.14,31.75 | 71.63,31.75 72.14,31.75 | 71.63,31.75 72.14,31.75 | HDDPWR.+5V 94.11,27.04 C6.1 | C6.1 95.89,32 IC1.OUT
12V
  Top 0.635: C3.1 54.1,38.1 55.12,37.08 55.12,33.27 54.23,32.38 54.23,30.61 54.61,30.23 54.61,27.69 55.88,26.42 55.88,16.38 58.42,13.84 58.42,8.38 61.72,5.08 U$24.12V U$24.12V1
  Bottom 0.254: 60.71,2.29 SJ100.1 60.71,2.29 | 60.71,2.29 U$24.12V
  Bottom 1.27: P2.VMOT JP2.2 | P3.VMOT JP4.2 | P4.VMOT JP6.2
  pour Top (no thermals): 6.6,12.19 6.6,18.29 8.89,18.29 8.89,12.19
  pour Bottom (isolate 0.254, no thermals): 2.54,36.58 2.54,40.89 5.33,43.69 12.7,43.69 14.22,42.16 14.22,41.15 14.48,40.89 31.5,40.89 31.75,41.15 31.75,42.93 32,43.18 34.04,43.18 34.29,42.93 34.29,41.15 34.54,40.89 51.82,40.89 52.07,41.15 52.07,42.93 52.32,43.18 54.36,43.18 54.61,42.93 54.61,41.15 54.86,40.89 72.14,40.89 72.39,41.15 72.39,42.93 72.64,43.18 74.68,43.18 74.93,42.93 74.93,41.15 75.18,40.89 97.54,40.89 98.42,40.01 98.42,36.58 14.22,36.58 13.46,37.34 11.94,37.34 11.94,38.61 10.41,40.13 7.62,40.13 7.62,22.1 9.53,20.19 15.88,20.19 15.88,18.67 12.06,18.67 8.89,15.49 8.89,12.19 6.6,12.19 4.57,14.22 4.57,18.03 1.78,20.83 1.78,24.38 2.54,25.15 2.54,31.5 1.78,32.26 1.78,35.81
!HOTBED
  Bottom 0.254: Q2.1 24.51,22.86 R11.P$1 25.43,21.95 29.46,21.95 29.57,21.95 IC2.20
!HOTEND
  Bottom 0.254: Q1.1 8.89,30.48 R6.P$1 14.73,24.64 18.54,24.64 30.73,24.64 31.5,25.4 33.02,25.4 IC2.19
!RESET
  Top 0.254: S1.3 85.16,6.28 U$24.RST
  Bottom 0.254: S1.4 S1.3 78.85,16.51 R12.P$1 73.15,16.51 69.85,19.81 65.91,19.81 64.14,21.59 60.45,21.59 59.69,22.35 | 59.69,22.35 IC2.9 | C7.1 50.8,22.48 51.82,21.46 58.8,21.46 59.69,22.35
!STEP-ENABLE
  Bottom 0.254: IC2.5 69.85,24.64 69.85,24.89 66.8,27.94 | P4.!EN 73.66,29.46 72.77,30.35 68.2,30.35 67.31,29.46 67.31,28.45 66.8,27.94 | 66.8,27.94 65.02,27.94 54.61,27.94 P3.!EN 52.07,27.94 34.29,27.94 P2.!EN 31.8,27.99 14.17,27.99 13.92,27.99 P1.!EN
#DTR  (via drill 0.38)
  Top 0.254: v32.44,18.95 33.71,17.68 v36.32,17.68
  Bottom 0.254: IC100.2 41.76,20.12 | IC100.2 38.73,20.09 v36.32,17.68 | v32.44,18.95 25.96,18.95 20.73,13.72 15.49,13.72 13.46,11.68 13.46,5.84 JP26.1 | C7.2 48.26,22.35 47.5,21.59 43.94,21.59 43.18,22.35 43.18,24.89 42.67,25.4 41.15,25.4 40.64,24.89 40.64,22.35 41.4,21.59 42.42,21.59 42.93,21.08 42.93,20.32 42.69,20.09 IC100.2
A0
  Top 0.254: IC2.40 80.01,3.81 U$24.A0
A1
  Top 0.254: IC2.39 77.47,3.81 U$24.A1
A2
  Top 0.254: IC2.38 74.93,3.81 U$24.A2
A3
  Top 0.254: IC2.37 72.39,3.81 U$24.A3
A4
  Top 0.254: IC2.36 69.85,3.81 U$24.A4
A5
  Top 0.254: IC2.35 67.31,3.81 U$24.A5
AITO  (via drill 0.38)
  Top 0.254: R7.P$1 29.97,24.64 29.97,19.05 29.97,18.29 v30.23,18.03
  Bottom 0.254: IC100.1 37.48,20.73 36.68,21.54 33.73,21.54 33.15,20.95 33.15,18.67 32.51,18.03 v30.23,18.03 25.91,18.03 21.08,13.21 15.75,13.21 13.97,11.43 13.97,3.81 JP26.3
AOTI  (via drill 0.38)
  Top 0.254: R8.P$1 38.1,18.8 v39.37,17.53
  Bottom 0.254: JP26.2 13.97,1.27 26.92,1.27 33.02,7.37 33.02,10.92 33.78,11.68 35.31,11.68 36.07,12.45 36.07,14.22 v39.37,17.53 39.98,18.14 IC100.5
B-THERM
  Top 0.254: R10.P$1 92.2,18.54 C9.1
  Bottom 0.254: IC2.34 65.79,7.87 92.69,7.87 95.5,7.87 JP24.1 93.73,11.68 93.73,12.68 93.73,17.27 R10.P$1
E-DIR
  Bottom 0.254: IC2.1 82.96,27.08 89.2,27.08 91.34,29.21 P4.DIR
E-MOT-1A
  Bottom 1.27: P4.1A JP7.3
E-MOT-1B
  Bottom 1.27: P4.1B JP7.4
E-MOT-2A
  Bottom 1.27: P4.2A JP7.2
E-MOT-2B
  Bottom 1.27: P4.2B JP7.1
E-MS1
  Top 0.254: P4.MS1 JP18.1
  Bottom 0.254: JP18.1 76.2,32.51 77.98,34.29 R5.P$1
E-MS2
  Bottom 0.254: P4.MS2 78.74,29.72 80.77,31.75 JP19.1
E-MS3
  Bottom 0.254: P4.MS3 82.42,30.35 87,30.35 87.5,30.35 JP20.1
E-RESETSLEEP
  Bottom 0.254: P4.!RST P4.!SLP
E-STEP
  Bottom 0.254: IC2.2 80.87,27.53 87.12,27.53 88.8,29.21 P4.STEP
E-THERM  (via drill 0.38)
  Top 0.254: v70.16,13.01 65.33,13.01 62.23,9.91 IC2.33 | v76.76,13.31 84.53,21.08 R9.P$1
  Bottom 0.254: v70.16,13.01 76.45,13.01 v76.76,13.31 | R9.P$1 87.39,21.08 C10.1 94.74,21.32 94.74,18.29 JP22.1
ENDSTOP+V
  Bottom 0.254: JP27.2 34.29,3.81 41.91,3.81 JP28.2 44.45,3.81 52.07,3.81 JP29.2 54.99,4.19 59.05,4.19 59.31,3.94 59.44,3.81 59.82,3.43 SJ100.2
GND
  pour Top (isolate 0.254, rank 2, no thermals): 0,50 100,50 100,0 0,0
  pour Bottom (isolate 0.254, rank 2, no thermals): 0,50 100,50 100,0 0,0
HOTBED-GND
  pour Top (isolate 0.254, no thermals): 2.29,29.97 3.81,29.97 7.62,26.16 9.91,26.16 10.16,25.91 10.16,24.89 9.91,24.64 4.06,24.64 2.79,25.91 2.29,25.91 1.78,26.42 1.78,29.46
HOTEND-GND
  pour Top (isolate 0.254, no thermals): 2.29,41.4 3.81,41.4 7.62,37.59 9.91,37.59 10.16,37.34 10.16,36.32 9.91,36.07 4.06,36.07 2.79,37.34 2.29,37.34 1.78,37.85 1.78,40.89
LED1
  Top 0.254: R1.P$1 90.04,45.59 LED1.A
PB5-MOSI
  Top 0.254: IC2.6 67.31,21.59 76.33,12.57 84.58,12.57 90.17,6.99 90.17,3.81 U$24.MOSI
PB6-MISO  (via drill 0.38)
  Top 0.254: v89.2,11.48 89.2,8.84 89.81,8.23 91.44,6.6 U$24.MISO
  Bottom 0.254: v89.2,11.48 86.56,11.48 79.65,18.39 72.03,18.39 70.1,20.32 66.17,20.32 65.66,20.83 64.77,21.72 64.77,22.71 IC2.7
PB7-SCK  (via drill 0.38)
  Top 0.254: v86.67,8.84 88.9,6.6 U$24.SCK | IC2.8 62.23,23.11 66.45,18.89 v67.18,18.89
  Bottom 0.254: v67.18,18.89 70.01,18.89 73.91,14.99 78.49,14.99 84.63,8.84 v86.67,8.84
PC0-SCL  (via drill 0.38)
  Top 0.254: v81.28,10.41 U$24.SCL
  Bottom 0.254: IC2.22 34.29,10.67 34.8,11.18 35.81,11.18 36.07,11.43 79.38,11.43 80.26,11.43 v81.28,10.41
PC1-SDA
  Bottom 0.254: IC2.23 36.83,8.38 37.34,7.87 54.86,7.87 55.37,7.37 63.25,7.37 64.77,5.84 64.77,4.32 65.28,3.81 77.47,3.81 U$24.SDA
PD0-RX0
  Bottom 0.254: IC2.14 45.97,25.15 43.69,25.15 42.93,25.91 40.89,25.91 40.13,25.15 37.08,25.15 R7.P$2
PD1-TX0
  Top 0.254: IC2.15 45.72,25.4 R8.P$2
PD2-RX1  (via drill 0.38)
  Top 0.254: v69.33,18.1 76.2,11.23 76.2,8.51 U$24.RX1
  Bottom 0.254: v69.33,18.1 66.53,18.1 63.7,20.93 43.79,20.93 41.91,22.81 IC2.16
PD3-TX1  (via drill 0.38)
  Top 0.254: IC2.17 39.37,23.14 v47.09,15.42 | v73.66,12.19 73.66,11.23 73.66,8.51 U$24.TX1
  Bottom 0.254: v47.09,15.42 50.32,12.19 v73.66,12.19
PD4-PWM  (via drill 0.38)
  Top 0.254: v66.24,13.92 70.41,13.92 71.12,13.21 U$24.PWM | v39.88,21.59 v43.69,17.78
  Bottom 0.254: v43.69,17.78 54.66,17.78 57.91,17.78 59.18,16.51 60.2,16.51 60.96,17.27 60.96,18.54 61.59,19.18 62.87,19.18 66.24,15.8 v66.24,13.92 | v39.88,21.59 37.59,21.59 36.83,22.35 IC2.18
USBDM
  Bottom 0.254: J1.D- 15.26,11.7 16.26,12.7 18.54,12.7 19.3,11.94 32.51,11.94 33.27,12.7 33.51,12.94 IC100.16
USBDP
  Bottom 0.254: IC100.15 33.62,12.29 33.53,12.19 32.77,11.43 19.05,11.43 18.29,12.19 17.27,12.19 16.51,11.43 16.51,10.41 15.26,9.16 J1.D+
X-DIR
  Top 0.254: IC2.27 46.99,10.67 46.99,10.92 45.21,12.7 42.27,12.7 37.03,17.93 35.56,19.41 35.56,24.64 34.8,25.4 33.27,25.4 32.77,25.4 32.51,25.65 30.48,27.69 P1.DIR
X-MOT-1A
  Bottom 1.27: P1.1A JP1.3
X-MOT-1B
  Bottom 1.27: P1.1B JP1.4
X-MOT-2A
  Bottom 1.27: P1.2A JP1.2
X-MOT-2B
  Bottom 1.27: P1.2B JP1.1
X-MS1
  Bottom 0.254: P1.MS1 JP9.1 15.24,32.51 17.02,34.29 R2.P$1
X-MS2
  Bottom 0.254: P1.MS2 17.78,29.72 19.81,31.75 JP10.1
X-MS3
  Bottom 0.254: P1.MS3 20.32,29.72 20.95,30.35 26.29,30.35 26.54,30.35 JP11.1
X-RESETSLEEP
  Bottom 0.254: P1.!RST P1.!SLP
X-STEP
  Top 0.254: P1.STEP 28.19,29.21 33.02,24.38 33.02,22.35 31.75,21.08 31.75,19.3 IC2.21
X-STOP
  Top 0.254: JP27.1 35.56,5.08 IC2.24
XTAL1
  Top 0.254: Y1.3 49.53,15.24 IC2.13
XTAL2
  Top 0.254: Y1.1 50.8,24.77 50.8,25.02 51.94,26.16 52.7,26.16 53.09,25.78 53.09,25.27 53.09,24.64 52.58,24.13 IC2.12
Y-DIR
  Top 0.254: P2.DIR 50.8,29.16 53.59,26.36 53.59,12.9 53.59,12.45 52.07,10.92 IC2.29
Y-MOT-1A
  Bottom 1.27: P2.1A JP3.3
Y-MOT-1B
  Bottom 1.27: P2.1B JP3.4
Y-MOT-2A
  Bottom 1.27: P2.2A JP3.2
Y-MOT-2B
  Bottom 1.27: P2.2B JP3.1
Y-MS1
  Top 0.254: P2.MS1 JP12.1
  Bottom 0.254: JP12.1 35.56,32.51 37.34,34.29 R3.P$1
Y-MS2
  Bottom 0.254: P2.MS2 38.1,29.72 40.13,31.75 JP13.1
Y-MS3
  Bottom 0.254: P2.MS3 40.64,29.72 41.27,30.35 46.86,30.35 JP14.1
Y-RESETSLEEP
  Bottom 0.254: P2.!RST P2.!SLP
Y-STEP
  Top 0.254: IC2.28 49.17,9.25 49.17,14.78 48.51,15.44 48.51,24.79 49.43,25.7 49.43,27.99 48.26,29.16 P2.STEP
Y-STOP
  Top 0.254: JP28.1 45.72,5.08 IC2.25
Z-DIR
  Bottom 0.254: IC2.3 71.12,27.94 P3.DIR
Z-MOT-1A
  Bottom 1.27: P3.1A JP5.3
Z-MOT-1B
  Bottom 1.27: P3.1B JP5.4
Z-MOT-2A
  Bottom 1.27: P3.2A JP5.2
Z-MOT-2B
  Bottom 1.27: P3.2B JP5.1
Z-MS1
  Top 0.254: P3.MS1 JP15.1
  Bottom 0.254: JP15.1 55.88,32.51 57.66,34.29 R4.P$1
Z-MS2
  Bottom 0.254: P3.MS2 58.42,29.72 60.45,31.75 JP16.1
Z-MS3
  Bottom 0.254: P3.MS3 62.1,30.35 66.8,30.35 67.18,30.35 JP17.1
Z-RESETSLEEP
  Bottom 0.254: P3.!RST P3.!SLP
Z-STEP
  Bottom 0.254: IC2.4 68.58,27.94 P3.STEP
Z-STOP
  Top 0.254: JP29.1 53.34,5.08 48.26,5.08 IC2.26

### Text on the board
_tsilk: POWER | X-MOTOR | 12V PWR | Y-MOTOR | 12V PWR | Z-MOTOR | 12V PWR | E-MOTOR | PWR1/TIP | 2B | 2A | 1A | 1B | GND | +12V | 2B | 2A | 1A | 1B | GND | +12V | 2B | 2A | 1A | 1B | GND | +12V | 2B | 2A | 1A | 1B | +12V | -V | POLOLU-X | POLOLU-Y | POLOLU-Z | POLOLU-E | C5 | C1 | C2 | C3 | C4 | R1 | +12V | R2 | R3 | R4 | R5 | Q1 | PWR2/BED | MS1 | MS2 | MS3 | MS1 | MS2 | MS3 | MS1 | MS2 | MS3 | MS1 | MS2 | MS3 | GND | C6 | -V | R7 | C7 | R6 | R8 | Sanguinololu | Rev 0.7 | +12V | C8 | C9 | C10 | +5V | Q2 | R9 | C12 | ATMEGA644P | GND | 12V | C11 | C13 | R10 | Y1 | R11 | C14 | R12 | RESET | E-THERM | C15 | S1 | C16 | reprap.org/wiki/sanguinololu | PWM | TX1 | RX1 | SDA | SCL | B-THERM | 12V | 5V | 5V | D12 | D11 | D10 | D17 | D16 | !RESET | SCK | MISO | GND | +V | SIG | GND | +V | SIG | GND | +V | SIG | X-STOP | Y-STOP | Z-STOP | USB2TTL | DTR | TX0 | RX0 | 5V | GND | GND | GND | GND | A5 | A4 | A3 | A2 | A1 | A0 | GND | MOSI | 5V
_bsilk: X-MOTOR | 12V PWR | Y-MOTOR | 12V PWR | Z-MOTOR | 12V PWR | E-MOTOR | 2B | 2A | 1A | 1B | GND | +12V | 2B | 2A | 1A | 1B | GND | +12V | 2B | 2A | 1A | 1B | GND | +12V | 2B | 2A | 1A | 1B | PWR1/TIP | +12V | -V | +12V | GND | PWR2/BED | -V | +12V | +5V | E-THERM | GND | 12V | FT232RL | B-THERM | PWM | TX1 | RX1 | SDA | SCL | STOP | 12V | 5V | 5V | D12 | D11 | D10 | D17 | D16 | GND | +V | SIG | GND | +V | SIG | GND | +V | SIG | VOLT | 5V | 12V | USB2TTL | DTR | TX0 | RX0 | 5V | GND | GND | X-STOP | Y-STOP | Z-STOP | GND | GND | A5 | A4 | A3 | A2 | A1 | A0